# Altium schematic sheet SoilSensorExpansion.SchDoc
size A; SheetNumber: 1; SheetTotal: 3
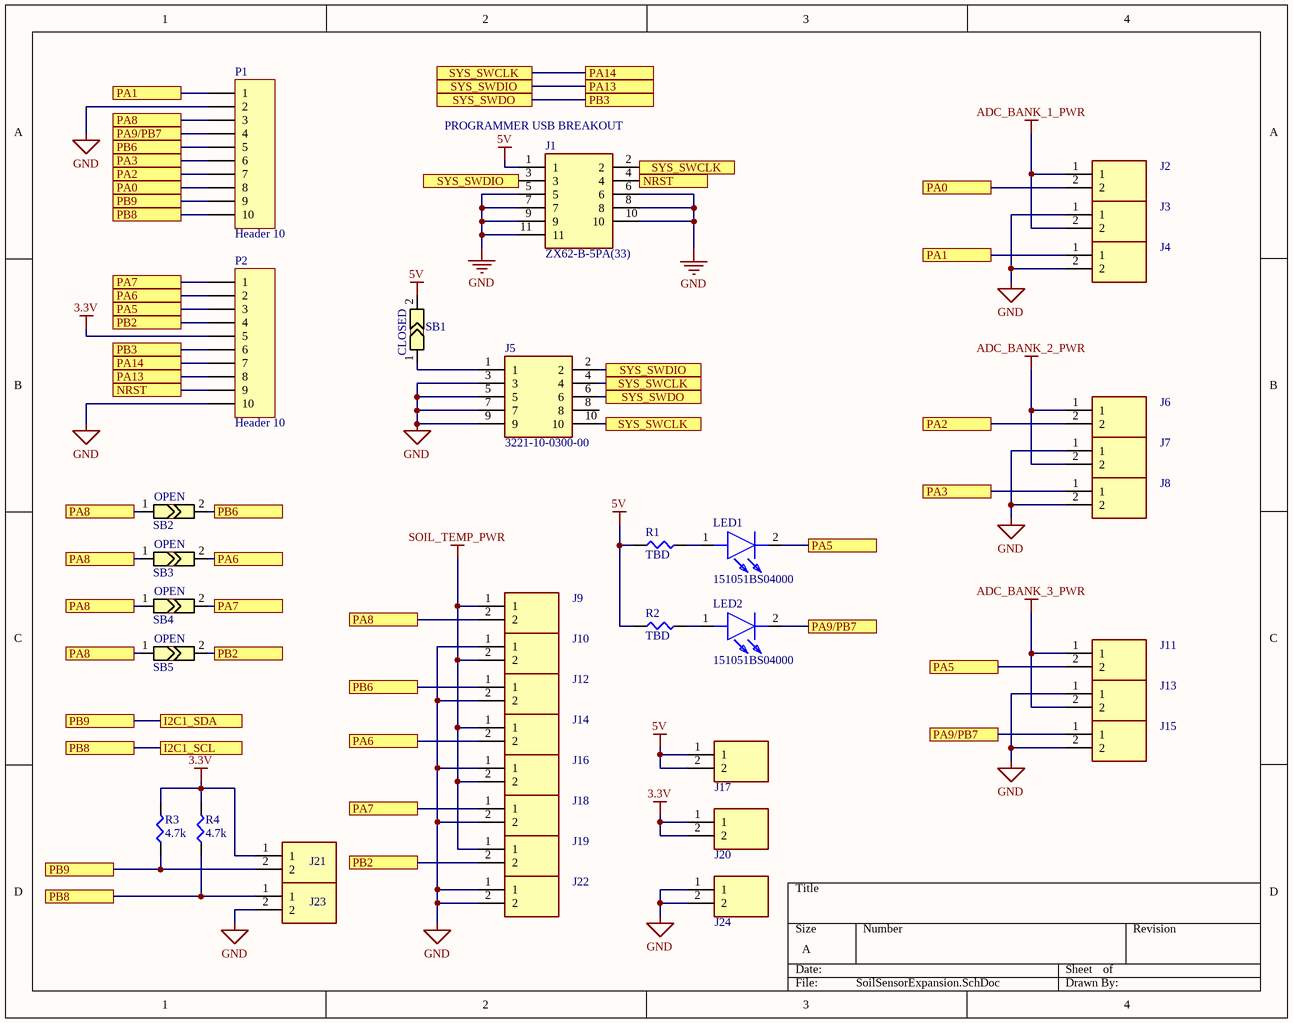
[diagram p0: SoilSensorExpansion.SchDoc]

## Parts
J1  ZX62-B-5PA(33)  [ZX62B5PA33]
J2  691214110002S  [691214110002S]  (value not drawn)
J3  691214110002S  [691214110002S]  (value not drawn)
J4  691214110002S  [691214110002S]  (value not drawn)
J5  3221-10-0300-00  [322110030000]
J6  691214110002S  [691214110002S]  (value not drawn)
J7  691214110002S  [691214110002S]  (value not drawn)
J8  691214110002S  [691214110002S]  (value not drawn)
J9  691214110002S  [691214110002S]  (value not drawn)
J10  691214110002S  [691214110002S]  (value not drawn)
J11  691214110002S  [691214110002S]  (value not drawn)
J12  691214110002S  [691214110002S]  (value not drawn)
J13  691214110002S  [691214110002S]  (value not drawn)
J14  691214110002S  [691214110002S]  (value not drawn)
J15  691214110002S  [691214110002S]  (value not drawn)
J16  691214110002S  [691214110002S]  (value not drawn)
J17  691214110002S  [691214110002S]  (value not drawn)
J18  691214110002S  [691214110002S]  (value not drawn)
J19  691214110002S  [691214110002S]  (value not drawn)
J20  691214110002S  [691214110002S]  (value not drawn)
J21  691214110002S  [691214110002S]  (value not drawn)
J22  691214110002S  [691214110002S]  (value not drawn)
J23  691214110002S  [691214110002S]  (value not drawn)
J24  691214110002S  [691214110002S]  (value not drawn)
LED1  151051BS04000  [151051BS04000]
LED2  151051BS04000  [151051BS04000]
P1  Header 10  [HDR1X10]
P2  Header 10  [HDR1X10]
R1  TBD  [SMD-0805-RES]
R2  TBD  [SMD-0805-RES]
R3  4.7k  [SMD-0402-RES]
R4  4.7k  [SMD-0402-RES]
SB1  SOLDER_JUMPER  [JUMPER_SMD]  (value not drawn)
SB2  SOLDER_JUMPER  [JUMPER_SMD]  (value not drawn)
SB3  SOLDER_JUMPER  [JUMPER_SMD]  (value not drawn)
SB4  SOLDER_JUMPER  [JUMPER_SMD]  (value not drawn)
SB5  SOLDER_JUMPER  [JUMPER_SMD]  (value not drawn)

## Ports
I2C1_SCL, I2C1_SDA, NRST, PA0, PA1, PA2, PA3, PA5, PA6, PA7, PA8, PA9/PB7, PA13, PA14, PB2, PB3, PB6, PB8, PB9, SYS_SWCLK, SYS_SWDIO, SYS_SWDO

## Nets
3.3V: J20.1 J20.2 J21.1 P2.5 R3.2 R4.2
5V: J1.1 J17.1 J17.2 R1.1 R2.1 SB1.2
ADC_BANK_1_PWR: J2.1 J3.2
ADC_BANK_2_PWR: J6.1 J7.2
ADC_BANK_3_PWR: J11.1 J13.2
GND: J1.5 J1.6 J1.7 J1.8 J1.9 J1.10 J1.11 J3.1 J4.2 J5.3 J5.5 J5.7 J5.9 J7.1 J8.2 J10.1 J12.2 J13.1 J15.2 J16.1 J18.2 J22.1 J22.2 J23.2 J24.1 J24.2 P1.2 P2.10
SOIL_TEMP_PWR: J9.1 J10.2 J14.1 J16.2 J19.1
I2C1_SCL: J23.1 P1.10 R4.1 ; port PB8, port I2C1_SCL
I2C1_SDA: J21.2 P1.9 R3.1 ; port PB9, port I2C1_SDA
NRST: J1.4 P2.9 ; port NRST
PA0: J2.2 P1.8 ; port PA0
PA1: J4.1 P1.1 ; port PA1
PA2: J6.2 P1.7 ; port PA2
PA3: J8.1 P1.6 ; port PA3
PA5: J11.2 LED1.2(K) P2.3 ; port PA5
PA6: J14.2 P2.2 SB3.2 ; port PA6
PA7: J18.1 P2.1 SB4.2 ; port PA7
PA8: J9.2 P1.3 SB2.1 SB3.1 SB4.1 SB5.1 ; port PA8
PA9/PB7: J15.1 LED2.2(K) P1.4 ; port PA9/PB7
PA13: J1.3 J5.2 P2.8 ; port PA13, port SYS_SWDIO
PA14: J1.2 J5.4 J5.10 P2.7 ; port PA14, port SYS_SWCLK
PB2: J19.2 P2.4 SB5.2 ; port PB2
PB3: J5.6 P2.6 ; port PB3, port SYS_SWDO
PB6: J12.1 P1.5 SB2.2 ; port PB6
NetJ5_1: J5.1 SB1.1
NetLED1_1: LED1.1(A) R1.2
NetLED2_1: LED2.1(A) R2.2

Not connected (* = marked no-connect by the designer): J5 8

## Notes on the sheet
- (near J1) PROGRAMMER USB BREAKOUT
- (near SB1) CLOSED
- (near SB2) OPEN
- (near SB3) OPEN
- (near SB4) OPEN
- (near SB5) OPEN

## Library data of the parts
J1 = ZX62-B-5PA(33): Connector; Manufacturer_Name: Hirose; Datasheet Link: http://www.mouser.com/ds/2/185/ZX_catalog-939768.pdf; Height: 2.8mm; Manufacturer_Part_Number: ZX62-B-5PA(33); Mouser Part Number: 798-ZX62-B-5PA33; Mouser Price/Stock: https://www.mouser.com/Search/Refine.aspx?Keyword=798-ZX62-B-5PA33; RS Part Number: 1362267; RS Price/Stock: http://uk.rs-online.com/web/p/products/1362267
J2-J4 J6-J24 = 691214110002S: Connector; Manufacturer_Name: Wurth Elektronik; Datasheet Link: https://katalog.we-online.de/em/datasheet/6912141100xx.pdf; Height: 8.7mm; Manufacturer_Part_Number: 691214110002S; Mouser Part Number: 710-691214110002S; Mouser Price/Stock: https://www.mouser.co.uk/ProductDetail/Wurth-Elektronik/691214110002S?qs=w%2Fv1CP2dgqrp3US926hqig%3D%3D
J5 = 3221-10-0300-00: Connector; Manufacturer_Name: CNC Tech; Datasheet Link: http://cnctech.us/pdfs/3221-XX-0300-00.pdf; Height: 5.8mm; Manufacturer_Part_Number: 3221-10-0300-00; Arrow Part Number: 3221-10-0300-00; Arrow Price/Stock: https://www.arrow.com/en/products/3221-10-0300-00/cnc-tech-llc
LED1 LED2 = 151051BS04000: LED; Manufacturer_Name: Wurth Elektronik; Datasheet Link: https://katalog.we-online.de/led/datasheet/151051BS04000.pdf; Height: 8.95mm; Manufacturer_Part_Number: 151051BS04000; Mouser Part Number: 710-151051BS04000; Mouser Price/Stock: https://www.mouser.co.uk/ProductDetail/Wurth-Elektronik/151051BS04000?qs=LlUlMxKIyB3OjuZOlqaOjg%3D%3D
P1 P2 = Header 10: Header, 10-Pin; LatestRevisionDate: 17-Jul-2002; LatestRevisionNote: Re-released for DXP Platform.; Publisher: Altium Limited
R1 R2 = ERJ-6ENF5492V: RES SMD 54.9K OHM 1% 1/8W 0805; Manufacturer: Panasonic Electronic Components; Factory Stock: 0; Unit Price (USD): 0.00729; @ qty: 1500; Minimum Quantity: 1; Power (Watts): 0.125W, 1/8W; Temperature Coefficient: ±100ppm/°C; Part Number: ERJ-6ENF5492V; Datasheets: http://industrial.panasonic.com/www-cgi/jvcr13pz.cgi?E+PZ+3+AOA0002+ERJ6ENF5492V+7+WW; Image: //media.digikey.com/Renders/Panasonic%20Renders/ERJ-0805%20Pkg.jpg; Digi-Key Part Number: P54.9KCCT-ND; Quantity Available: 38560; Packaging: Cut Tape (CT); Series: ERJ; Part Status: Active; Value: 54.9k; Tolerance: ±1%; Composition: Thick Film; Features: Automotive AEC-Q200; Operating Temperature: -55°C ~ 155°C; Package / Case: 0805 (2012 Metric); Supplier Device Package: 0805; Size / Dimension: 0.079" L x 0.049" W (2.00mm x 1.25mm); Height - Seated (Max): 0.028" (0.70mm); Number of Terminations: 2; Failure Rate: -
R3 R4 = ERJ-2GEJ103X: RES SMD 4.7K OHM 5% 1/10W 0402; Manufacturer: Panasonic Electronic Components; Factory Stock: 0; Unit Price (USD): 0.00350; @ qty: 1500; Minimum Quantity: 1; Power (Watts): 0.1W, 1/10W; Temperature Coefficient: ±200ppm/°C; Part Number: ERJ-2GEJ103X; Datasheets: http://industrial.panasonic.com/www-cgi/jvcr13pz.cgi?E+PZ+3+AOA0001+ERJ2GEJ103X+7+WW; Image: //media.digikey.com/Photos/Panasonic%20Photos/ERJ-PA2-Series.jpg; Digi-Key Part Number: P10KJCT-ND; Quantity Available: 2560215; Packaging: Cut Tape (CT); Series: ERJ; Part Status: Active; Value: 4.7k; Tolerance: ±5%; Composition: Thick Film; Features: Automotive AEC-Q200; Operating Temperature: -55°C ~ 155°C; Package / Case: 0402 (1005 Metric); Supplier Device Package: 0402; Size / Dimension: 0.039" L x 0.020" W (1.00mm x 0.50mm); Height - Seated (Max): 0.016" (0.40mm); Number of Terminations: 2; Failure Rate: -